# Altium schematic sheet General_design.SchDoc
size A3; Organization: Altium Limited; Address1: L3, 12a Rodborough Rd; Address2: Frenchs Forest; Address3: NSW; Address4: Australia 2086
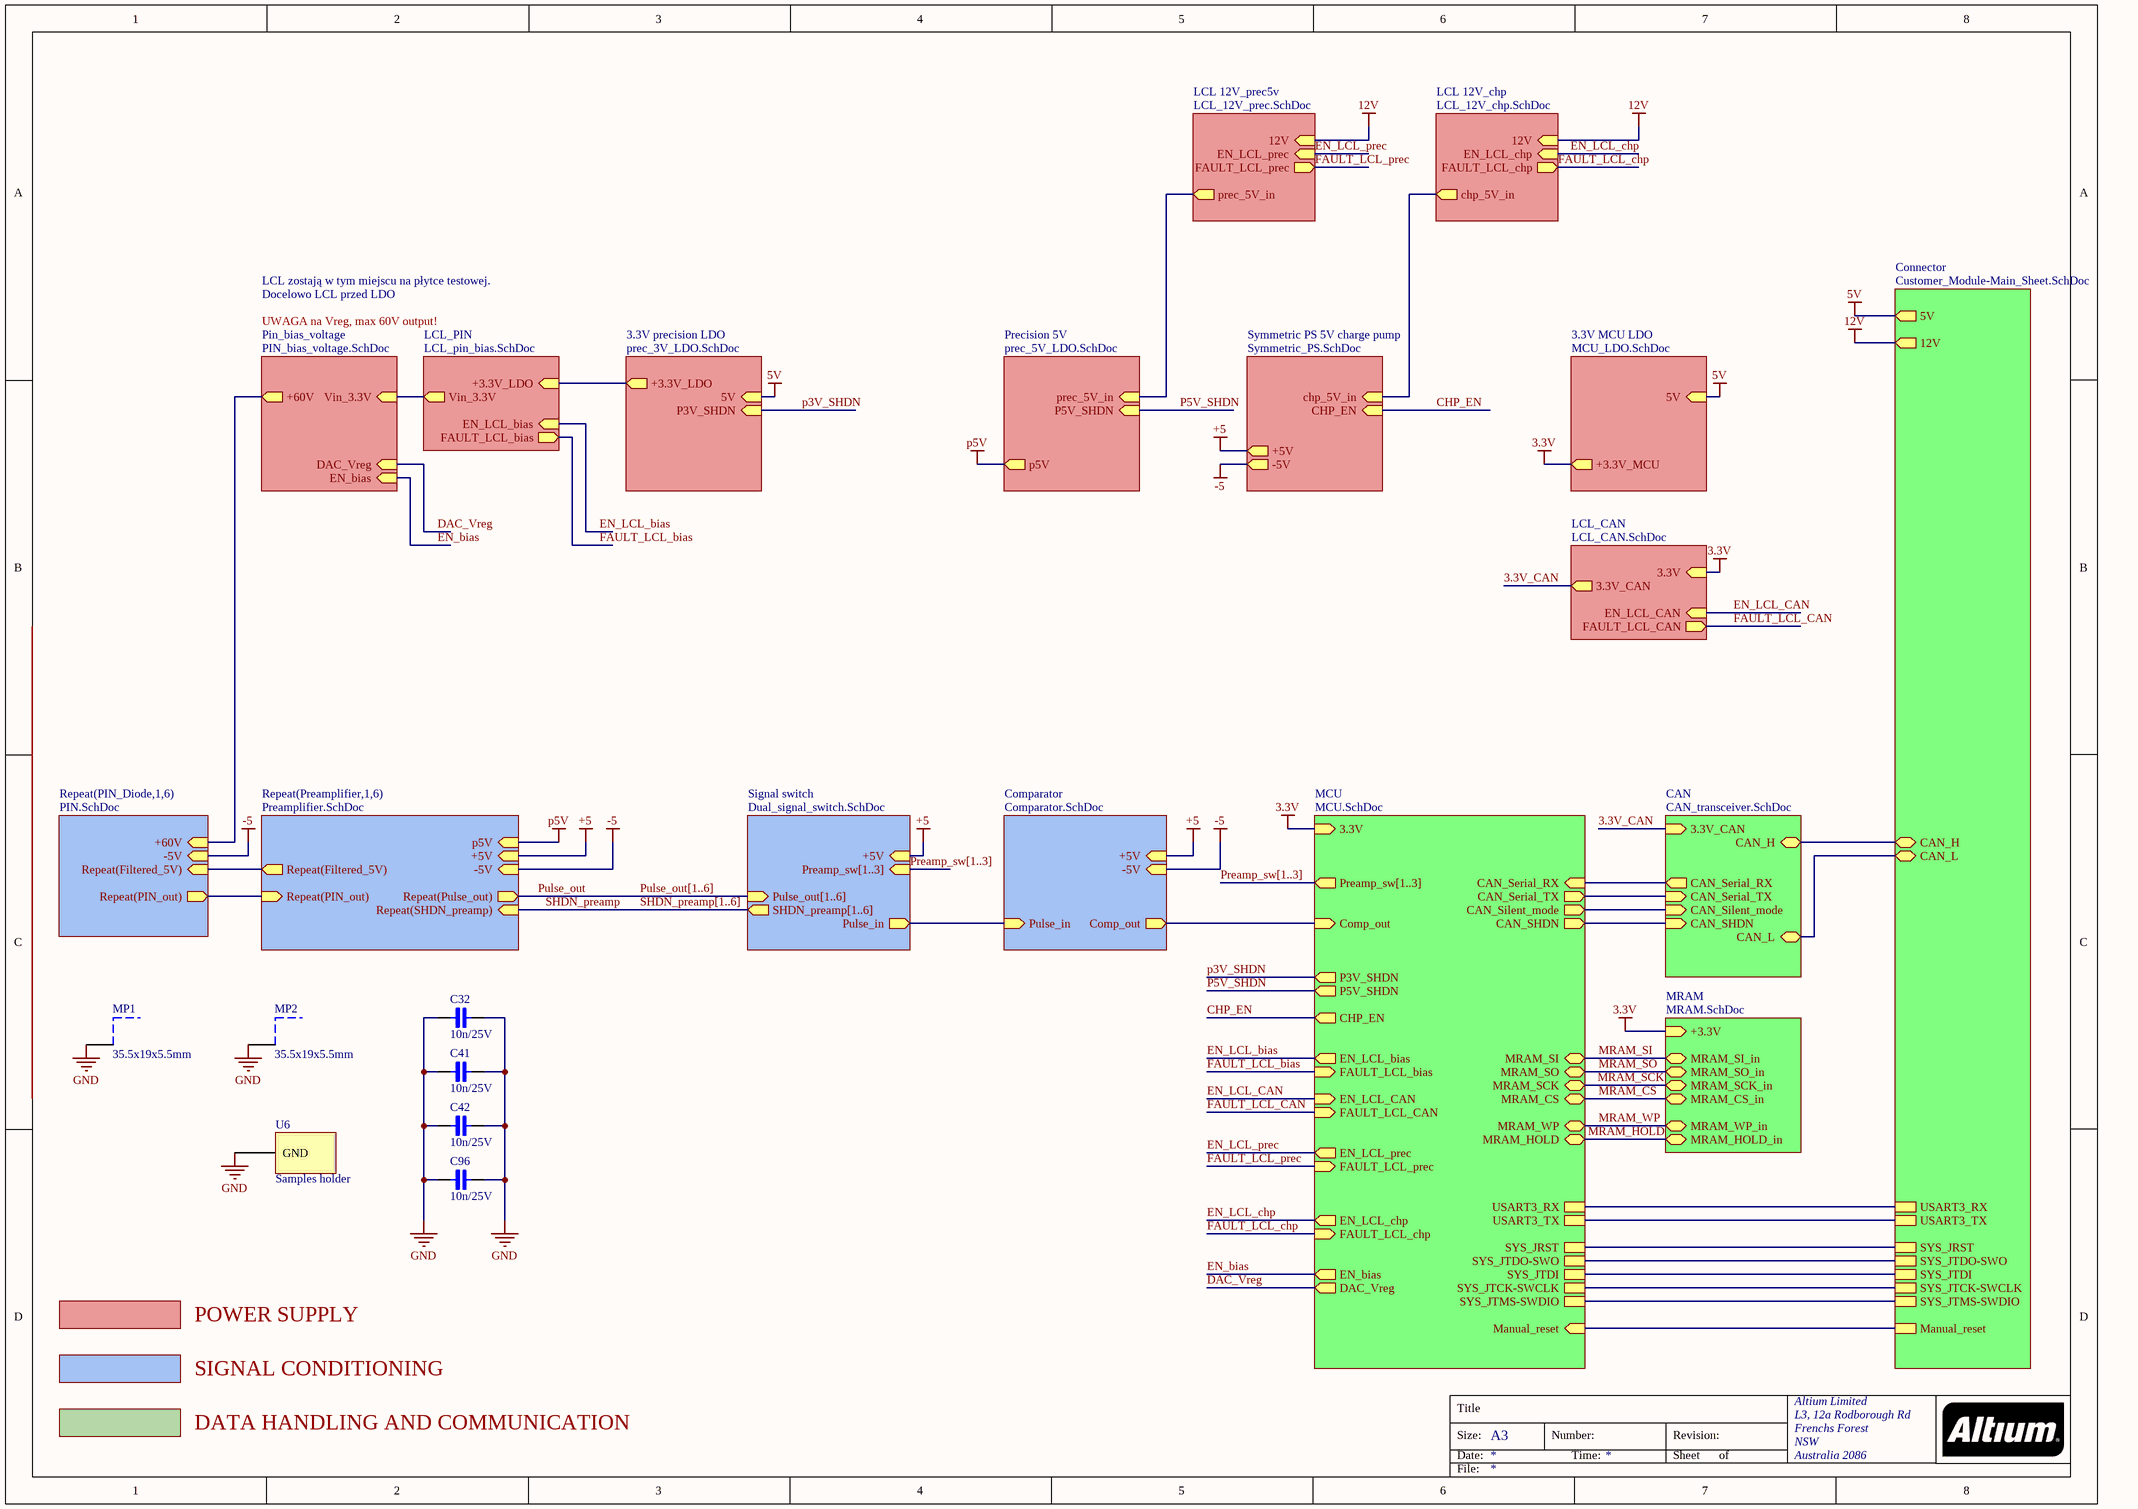
[diagram p0: General_design.SchDoc]

## Parts
C32  10n/25V  [Cap_0402]
C41  10n/25V  [Cap_0402]
C42  10n/25V  [Cap_0402]
C96  10n/25V  [Cap_0402]
MP1  35.5x19x5.5mm  [Shiled_35x19]
MP2  35.5x19x5.5mm  [Shiled_35x19]
U6  Samples holder  [RAD_Samples_Holder]

## Sub-sheets
3.3V MCU LDO = MCU_LDO.SchDoc: 5V (in), +3.3V_MCU (out)
3.3V precision LDO = prec_3V_LDO.SchDoc: +3.3V_LDO (out), 5V (in), P3V_SHDN (in)
CAN = CAN_transceiver.SchDoc: 3.3V_CAN (in), CAN_Serial_RX (out), CAN_Serial_TX (in), CAN_H (bidir), CAN_L (bidir), CAN_Silent_mode (in), CAN_SHDN (in)
Comparator = Comparator.SchDoc: Pulse_in (in), Comp_out (out), +5V (in), -5V (in)
Connector = Customer_Module-Main_Sheet.SchDoc: 12V (out), 5V (out), CAN_H (bidir), CAN_L (bidir), SYS_JRST, SYS_JTDO-SWO, SYS_JTDI, SYS_JTCK-SWCLK, SYS_JTMS-SWDIO, USART3_RX, USART3_TX, Manual_reset
LCL 12V_chp = LCL_12V_chp.SchDoc: 12V (in), chp_5V_in (out), EN_LCL_chp (in), FAULT_LCL_chp (out)
LCL 12V_prec5v = LCL_12V_prec.SchDoc: 12V (in), prec_5V_in (out), EN_LCL_prec (in), FAULT_LCL_prec (out)
LCL_CAN = LCL_CAN.SchDoc: EN_LCL_CAN (in), FAULT_LCL_CAN (out), 3.3V (in), 3.3V_CAN (out)
LCL_PIN = LCL_pin_bias.SchDoc: EN_LCL_bias (in), FAULT_LCL_bias (out), +3.3V_LDO (in), Vin_3.3V (out)
MCU = MCU.SchDoc: 3.3V (in), Preamp_sw[1..3] (out), Comp_out (in), P3V_SHDN (out), P5V_SHDN (out), CHP_EN (out), EN_LCL_bias (out), FAULT_LCL_bias (in), EN_LCL_prec (out), FAULT_LCL_prec (in), EN_LCL_chp (out), FAULT_LCL_chp (in), EN_bias (out), CAN_Serial_RX (in), CAN_Serial_TX (out), CAN_Silent_mode (out), MRAM_SO (bidir), MRAM_SCK (bidir), MRAM_WP (bidir), MRAM_HOLD (bidir), MRAM_CS (bidir), MRAM_SI (bidir), DAC_Vreg (out), CAN_SHDN (out), SYS_JRST, SYS_JTDO-SWO, SYS_JTDI, SYS_JTCK-SWCLK, SYS_JTMS-SWDIO, USART3_RX, USART3_TX, Manual_reset (in), EN_LCL_CAN (in), FAULT_LCL_CAN (in)
MRAM = MRAM.SchDoc: MRAM_SO_in (bidir), MRAM_SCK_in (bidir), +3.3V (in), MRAM_WP_in (bidir), MRAM_HOLD_in (bidir), MRAM_CS_in (bidir), MRAM_SI_in (bidir)
Pin_bias_voltage = PIN_bias_voltage.SchDoc: +60V (out), Vin_3.3V (in), EN_bias (in), DAC_Vreg (in)
Precision 5V = prec_5V_LDO.SchDoc: prec_5V_in (in), p5V (out), P5V_SHDN (in)
Repeat(PIN_Diode,1,6) = PIN.SchDoc: -5V (in), +60V (in), Repeat(Filtered_5V) (in), Repeat(PIN_out) (out)
Repeat(Preamplifier,1,6) = Preamplifier.SchDoc: Repeat(Filtered_5V) (out), Repeat(PIN_out) (in), Repeat(Pulse_out) (out), +5V (in), -5V (in), p5V (in), Repeat(SHDN_preamp) (in)
Signal switch = Dual_signal_switch.SchDoc: Pulse_out[1..6] (in), Pulse_in (out), +5V (in), Preamp_sw[1..3] (in), SHDN_preamp[1..6] (out)
Symmetric PS 5V charge pump = Symmetric_PS.SchDoc: +5V (out), -5V (out), chp_5V_in (in), CHP_EN (in)

## Nets
3.3V: sheet MCU/3.3V, sheet MRAM/+3.3V, sheet 3.3V MCU LDO/+3.3V_MCU, sheet LCL_CAN/3.3V
5V: sheet Connector/5V, sheet 3.3V precision LDO/5V, sheet 3.3V MCU LDO/5V
12V: sheet Connector/12V, sheet LCL 12V_prec5v/12V, sheet LCL 12V_chp/12V
+5: sheet Repeat(Preamplifier,1,6)/+5V, sheet Comparator/+5V, sheet Symmetric PS 5V charge pump/+5V, sheet Signal switch/+5V
-5: sheet Repeat(PIN_Diode,1,6)/-5V, sheet Repeat(Preamplifier,1,6)/-5V, sheet Comparator/-5V, sheet Symmetric PS 5V charge pump/-5V
GND: C32.1 C32.2 C41.1 C41.2 C42.1 C42.2 C96.1 C96.2 MP1.1 MP2.1 U6.5(GND)
p5V: sheet Repeat(Preamplifier,1,6)/p5V, sheet Precision 5V/p5V
3.3V_CAN: sheet CAN/3.3V_CAN, sheet LCL_CAN/3.3V_CAN
CHP_EN: sheet MCU/CHP_EN, sheet Symmetric PS 5V charge pump/CHP_EN
DAC_Vreg: sheet Pin_bias_voltage/DAC_Vreg, sheet MCU/DAC_Vreg
EN_bias: sheet Pin_bias_voltage/EN_bias, sheet MCU/EN_bias
EN_LCL_bias: sheet MCU/EN_LCL_bias, sheet LCL_PIN/EN_LCL_bias
EN_LCL_CAN: sheet MCU/EN_LCL_CAN, sheet LCL_CAN/EN_LCL_CAN
EN_LCL_chp: sheet MCU/EN_LCL_chp, sheet LCL 12V_chp/EN_LCL_chp
EN_LCL_prec: sheet MCU/EN_LCL_prec, sheet LCL 12V_prec5v/EN_LCL_prec
FAULT_LCL_bias: sheet MCU/FAULT_LCL_bias, sheet LCL_PIN/FAULT_LCL_bias
FAULT_LCL_CAN: sheet MCU/FAULT_LCL_CAN, sheet LCL_CAN/FAULT_LCL_CAN
FAULT_LCL_chp: sheet MCU/FAULT_LCL_chp, sheet LCL 12V_chp/FAULT_LCL_chp
FAULT_LCL_prec: sheet MCU/FAULT_LCL_prec, sheet LCL 12V_prec5v/FAULT_LCL_prec
MRAM_CS: sheet MCU/MRAM_CS, sheet MRAM/MRAM_CS_in
MRAM_HOLD: sheet MCU/MRAM_HOLD, sheet MRAM/MRAM_HOLD_in
MRAM_SCK: sheet MCU/MRAM_SCK, sheet MRAM/MRAM_SCK_in
MRAM_SI: sheet MCU/MRAM_SI, sheet MRAM/MRAM_SI_in
MRAM_SO: sheet MCU/MRAM_SO, sheet MRAM/MRAM_SO_in
MRAM_WP: sheet MCU/MRAM_WP, sheet MRAM/MRAM_WP_in
p3V_SHDN: sheet MCU/P3V_SHDN, sheet 3.3V precision LDO/P3V_SHDN
P5V_SHDN: sheet MCU/P5V_SHDN, sheet Precision 5V/P5V_SHDN
Pulse_out: sheet Repeat(Preamplifier,1,6)/Repeat(Pulse_out)  [also labelled Pulse_out[1..6]]
SHDN_preamp: sheet Repeat(Preamplifier,1,6)/Repeat(SHDN_preamp)  [also labelled SHDN_preamp[1..6]]
(unnamed): sheet Repeat(PIN_Diode,1,6)/+60V, sheet Pin_bias_voltage/+60V
(unnamed): sheet Repeat(PIN_Diode,1,6)/Repeat(Filtered_5V), sheet Repeat(Preamplifier,1,6)/Repeat(Filtered_5V)
(unnamed): sheet Repeat(PIN_Diode,1,6)/Repeat(PIN_out), sheet Repeat(Preamplifier,1,6)/Repeat(PIN_out)
(unnamed): sheet Pin_bias_voltage/Vin_3.3V, sheet LCL_PIN/Vin_3.3V
(unnamed): sheet MCU/Comp_out, sheet Comparator/Comp_out
(unnamed): sheet MCU/CAN_Serial_RX, sheet CAN/CAN_Serial_RX
(unnamed): sheet MCU/CAN_Serial_TX, sheet CAN/CAN_Serial_TX
(unnamed): sheet MCU/CAN_Silent_mode, sheet CAN/CAN_Silent_mode
(unnamed): sheet MCU/CAN_SHDN, sheet CAN/CAN_SHDN
(unnamed): sheet MCU/SYS_JRST, sheet Connector/SYS_JRST
(unnamed): sheet MCU/SYS_JTDO-SWO, sheet Connector/SYS_JTDO-SWO
(unnamed): sheet MCU/SYS_JTDI, sheet Connector/SYS_JTDI
(unnamed): sheet MCU/SYS_JTCK-SWCLK, sheet Connector/SYS_JTCK-SWCLK
(unnamed): sheet MCU/SYS_JTMS-SWDIO, sheet Connector/SYS_JTMS-SWDIO
(unnamed): sheet MCU/USART3_RX, sheet Connector/USART3_RX
(unnamed): sheet MCU/USART3_TX, sheet Connector/USART3_TX
(unnamed): sheet MCU/Manual_reset, sheet Connector/Manual_reset
(unnamed): sheet Connector/CAN_H, sheet CAN/CAN_H
(unnamed): sheet Connector/CAN_L, sheet CAN/CAN_L
(unnamed): sheet Comparator/Pulse_in, sheet Signal switch/Pulse_in
(unnamed): sheet Symmetric PS 5V charge pump/chp_5V_in, sheet LCL 12V_chp/chp_5V_in
(unnamed): sheet 3.3V precision LDO/+3.3V_LDO, sheet LCL_PIN/+3.3V_LDO
(unnamed): sheet Precision 5V/prec_5V_in, sheet LCL 12V_prec5v/prec_5V_in

## Buses and harness runs
bus Preamp_sw[1..3] = sheet MCU/Preamp_sw[1..3]
bus Preamp_sw[1..3] = sheet Signal switch/Preamp_sw[1..3]

## Notes on the sheet
- LCL zostają w tym miejscu na płytce testowej.
- Docelowo LCL przed LDO
- UWAGA na Vreg, max 60V output!
- POWER SUPPLY
- SIGNAL CONDITIONING
- DATA HANDLING AND COMMUNICATION
- Title
- Size:
- Date:
- A3
- Number:
- Time:
- Revision:
- Sheet
- of
- File:

## Library data of the parts
C32 C41 C42 C96 = Cap_0402_10n: Ceramic Capacitor 10n / 0402 / 25V / ±5%, Wurth Elektronik MLCC; ComponentLink1Description: New link; ComponentLink1URL: https://www.we-online.com/catalog/en/WCAP-CSGP-25VDC
MP1 MP2 = Shield 35x19: WE-SHC Shielding Cabinet, SMT Frame Seamless, Tin Plated, Tray, 35.5x19x5.5mm; Manufacturer Part Number: 3670355; Manufacturer: Wurth Elektronik; Base Material: Steel; Type: SMT Frame Seamless; Width: 19mm; Published Date: November 2020; Plating: Tin Plated; Packaging: Tray; Operating Temperature: -40 to +125degC; Mounting Technology: SMT; Length: 35.5mm; Height: 5.5mm; ComponentLink2URL: https://www.we-online.com/catalog/datasheet/3670355.pdf; ComponentLink2Description: Datasheet; ComponentLink1URL: http://www.we-online.de; ComponentLink1Description: Manufacturer
U6 = RAD_samples_holder: Mechanical aprt